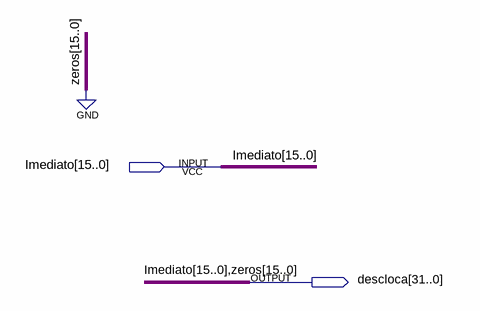
[diagram p0: schematic sheet]
// Quartus schematic Lui.bdf as structural Verilog: 0 symbols, 2 pins
module Lui (
  input  [15:0] Imediato,
  output [31:0] descloca
);


  assign descloca = {Imediato, {16{1'b0}}};
endmodule
